# EAGLE design MYC_Klimasensor (EAGLE 7.3.0)
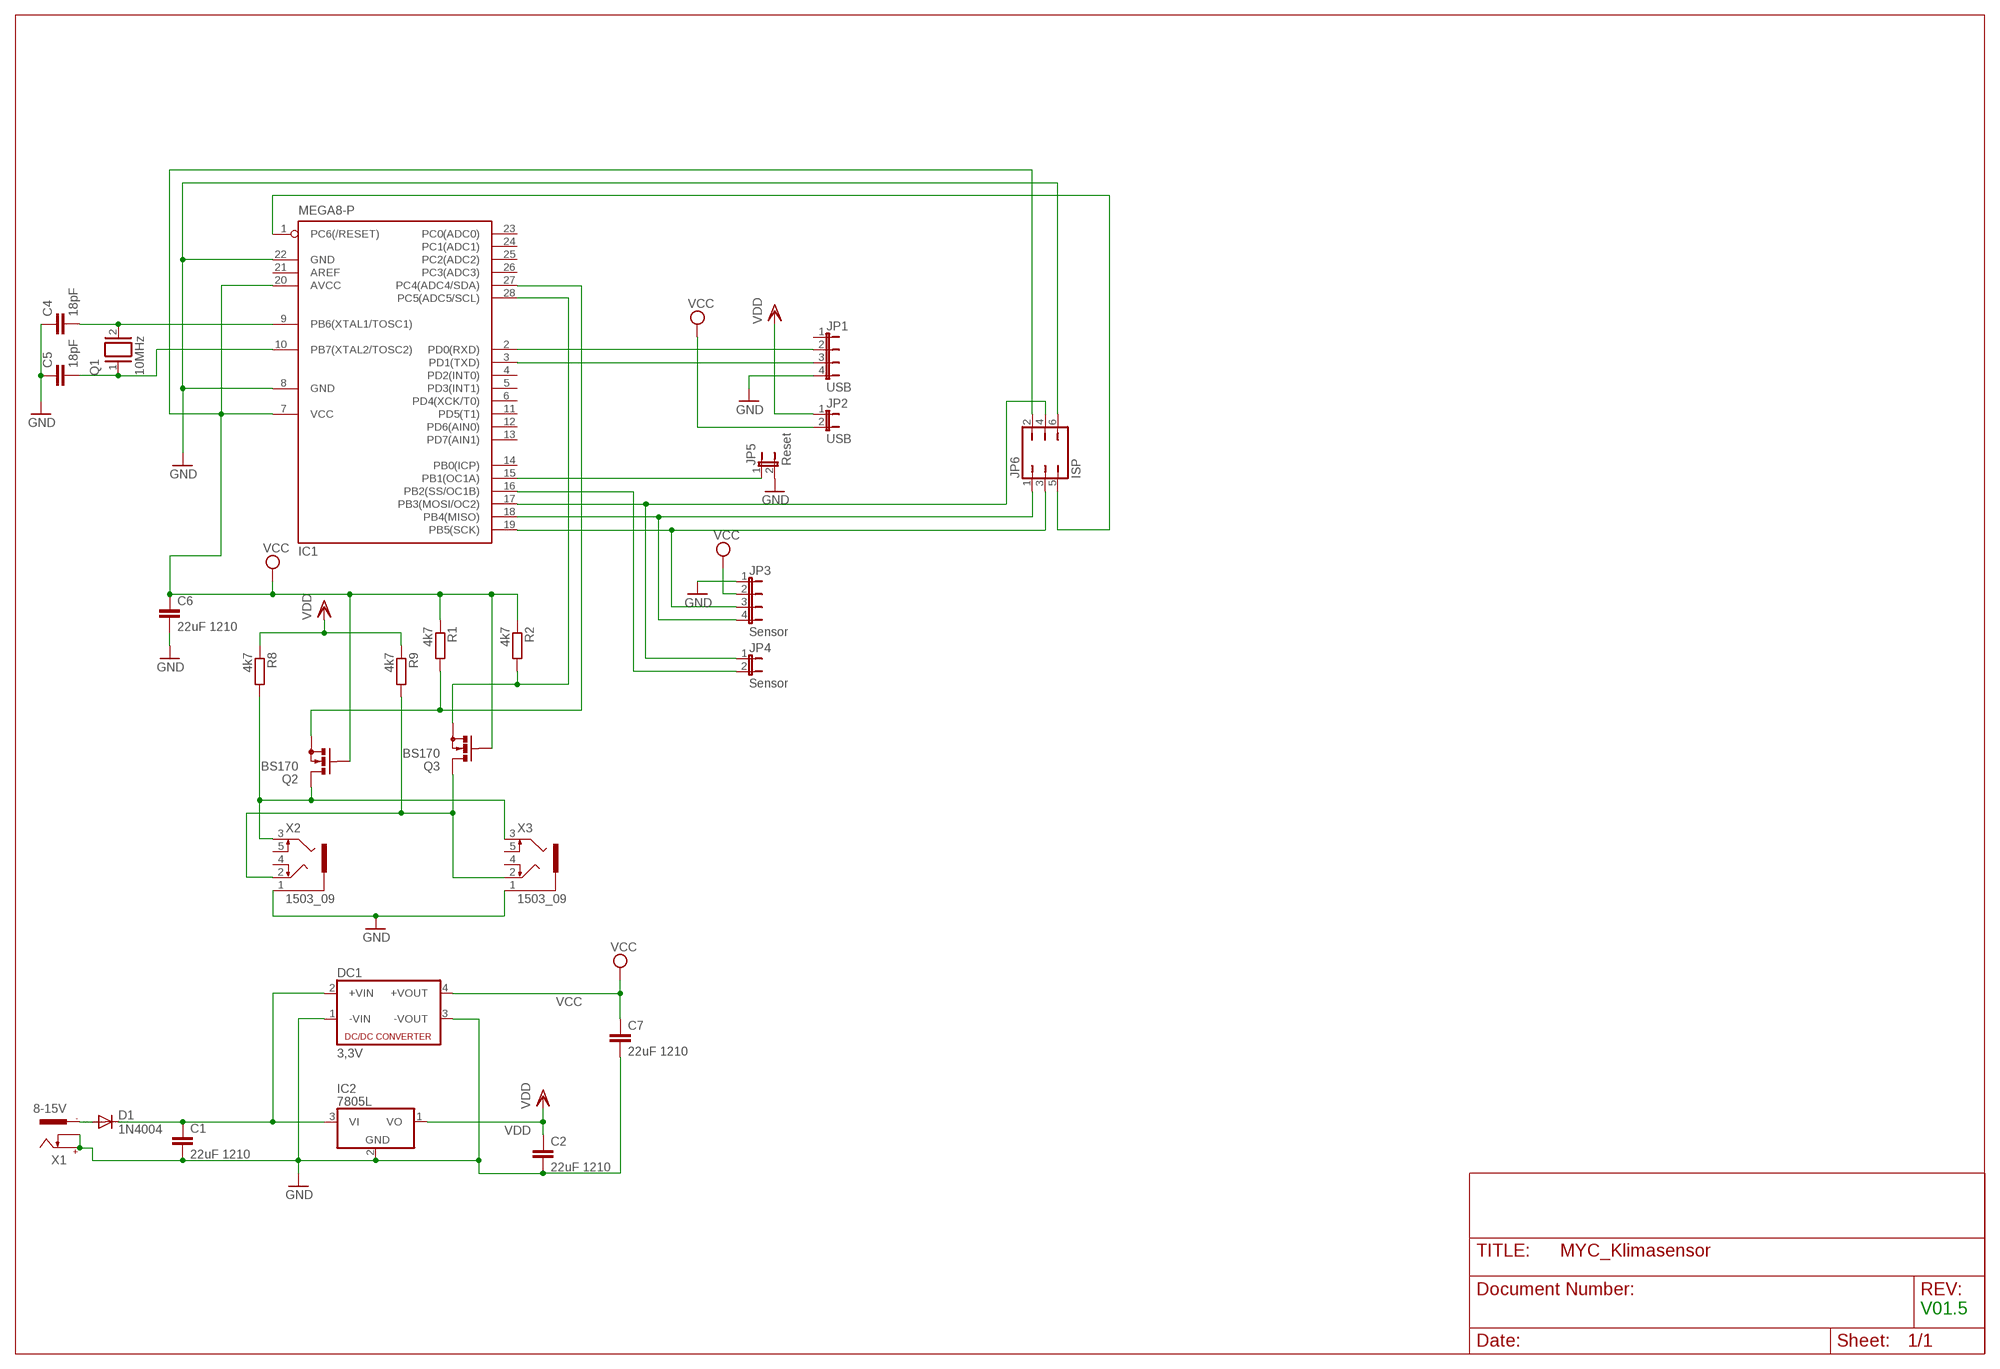
[diagram p0: schematic, sheet 1]

## Parts
C1  22uF 1210  C-EUC1206  [C1206]
C2  22uF 1210  C-EUC1206  [C1206]
C4  18pF  C-EU025-025X050  [C025-025X050]
C5  18pF  C-EU025-025X050  [C025-025X050]
C6  22uF 1210  C-EUC1206  [C1206]
C7  22uF 1210  C-EUC1206  [C1206]
D1  1N4004  [DO41-10]
DC1  3,3V  NME  [NME]
IC1  MEGA8-P  [DIL28-3]
IC2  7805L  [TO92]
JP1  USB  JP4E  [JP4]
JP2  USB  JP1E  [JP1]
JP3  Sensor  JP4E  [JP4]
JP4  Sensor  JP1E  [JP1]
JP5  Reset  JP1E  [JP1]
JP6  ISP  JP3Q  [JP3Q]
Q1  10MHz  XTAL/S  [QS]
Q2  BS170  [SOT54E]
Q3  BS170  [SOT54E]
R1  4k7  R-EU_R1206  [R1206]
R2  4k7  R-EU_R1206  [R1206]
R8  4k7  R-EU_R1206  [R1206]
R9  4k7  R-EU_R1206  [R1206]
X1  8-15V  737992-55  [737992-5]
X2  1503_09  [1503_09]
X3  1503_09  [1503_09]

## Nets
GND: C1.2 C2.2 C4.1 C5.1 C6.2 C7.2 DC1.1(-VIN) DC1.3(-VOUT) IC1.8(GND) IC1.22(GND) IC2.2(GND) JP1.4 JP3.1 JP5.2 JP6.6 X1.+ X1.K X2.1 X3.1
N$1: Q2.D R8.2 X2.3 X3.3
N$2: IC1.17(PB3(MOSI/OC2)) JP4.1 JP6.4
N$3: C1.1 D1.C DC1.2(+VIN) IC2.3(VI)
N$4: IC1.2(PD0(RXD)) JP1.2
N$5: IC1.27(PC4(ADC4/SDA)) Q2.S R1.2
N$7: IC1.28(PC5(ADC5/SCL)) Q3.S R2.2
N$8: IC1.19(PB5(SCK)) JP3.3 JP6.3
N$9: IC1.15(PB1(OC1A)) JP5.1
N$10: IC1.3(PD1(TXD)) JP1.3
N$11: IC1.16(PB2(SS/OC1B)) JP4.2
N$15: IC1.18(PB4(MISO)) JP3.4 JP6.1
N$18: IC1.1(PC6(/RESET)) JP6.5
N$19: C4.2 IC1.9(PB6(XTAL1/TOSC1)) Q1.2
N$22: Q3.D R9.2 X2.2 X3.2
N$27: D1.A X1.-1
N$37: C5.2 IC1.10(PB7(XTAL2/TOSC2)) Q1.1
VCC: C6.1 C7.1 DC1.4(+VOUT) IC1.7(VCC) IC1.20(AVCC) JP2.2 JP3.2 JP6.2 Q2.G Q3.G R1.1 R2.1
VDD: C2.1 IC2.1(VO) JP2.1 R8.1 R9.1
Unconnected: IC1.4(PD2(INT0)) IC1.5(PD3(INT1)) IC1.6(PD4(XCK/T0)) IC1.11(PD5(T1)) IC1.12(PD6(AIN0)) IC1.13(PD7(AIN1)) IC1.14(PB0(ICP)) IC1.21(AREF) IC1.23(PC0(ADC0)) IC1.24(PC1(ADC1)) IC1.25(PC2(ADC2)) IC1.26(PC3(ADC3)) JP1.1 X1.-2 X2.4 X2.5 X3.4 X3.5

## Notes on the sheet
- V01.5

## Library data of the parts
C1 C2 C6 C7 = rcl:C-EU: CAPACITOR, European symbol
C4 C5 = resistor:C-EU: CAPACITOR, European symbol
D1 = diode:1N4004: DIODE general purpose rectifier, 1 A
DC1 = dc-dc-converter:NME: DC-DC CONVERTER; MF: C & D TECHNOLOGIES, INC; MPN: NME1205D; OC_FARNELL: 1021466; OC_NEWARK: 98B8198
IC1 = atmel:MEGA8-P: MICROCONTROLLER 8 Kbytes FLASH, 1 kbytes SRAM, 512 bytes EEPROM, USART, 4-channel 10 bit ADC, 2-channel 8 bit ADC Pin compatible with Atmega48, ATMega88, ATMega168 Source: avr.lbr; OC_FARNELL: unknown; OC_NEWARK: unknown
IC2 = linear:78*: Positive VOLTAGE REGULATOR Source: http://cache.national.com/ds/LM/LM78L05.pdf http://www.fairchildsemi.com/ds/LM/LM7805.pdf
JP1 JP3 = jumper:JP4E: JUMPER
JP2 JP4 JP5 = jumper:JP1E: JUMPER
JP6 = jumper:JP3Q: JUMPER
Q1 = special:XTAL/S: CRYSTAL
Q2 Q3 = transistor-small-signal:BS170: N-CHANNEL MOS FET
R1 R2 R8 R9 = resistor:R-EU_: RESISTOR, European symbol
X1 = con-conrad:737992-55: FEMALE PRINT CONNECTOR DIN 45323 (34V/3A), ROKA, distributor Conrad
X2 X3 = con-lumberg:1503_09: Jack connectors according to JISC 6560, 3.5 mm Klinkeneinbaukupplung nach JISC 6560, 3,5 mm, 3-polig/ stereo, abgewinkelte Ausführung, mit 2 Öffnern und Lötaugen, für Leiterplatten Rückseitenmontage Source: http://www.lumberg.com/Produkte/PDFs/1503_09.pdf; OC_FARNELL: 1243244; OC_NEWARK: unknown

## Board
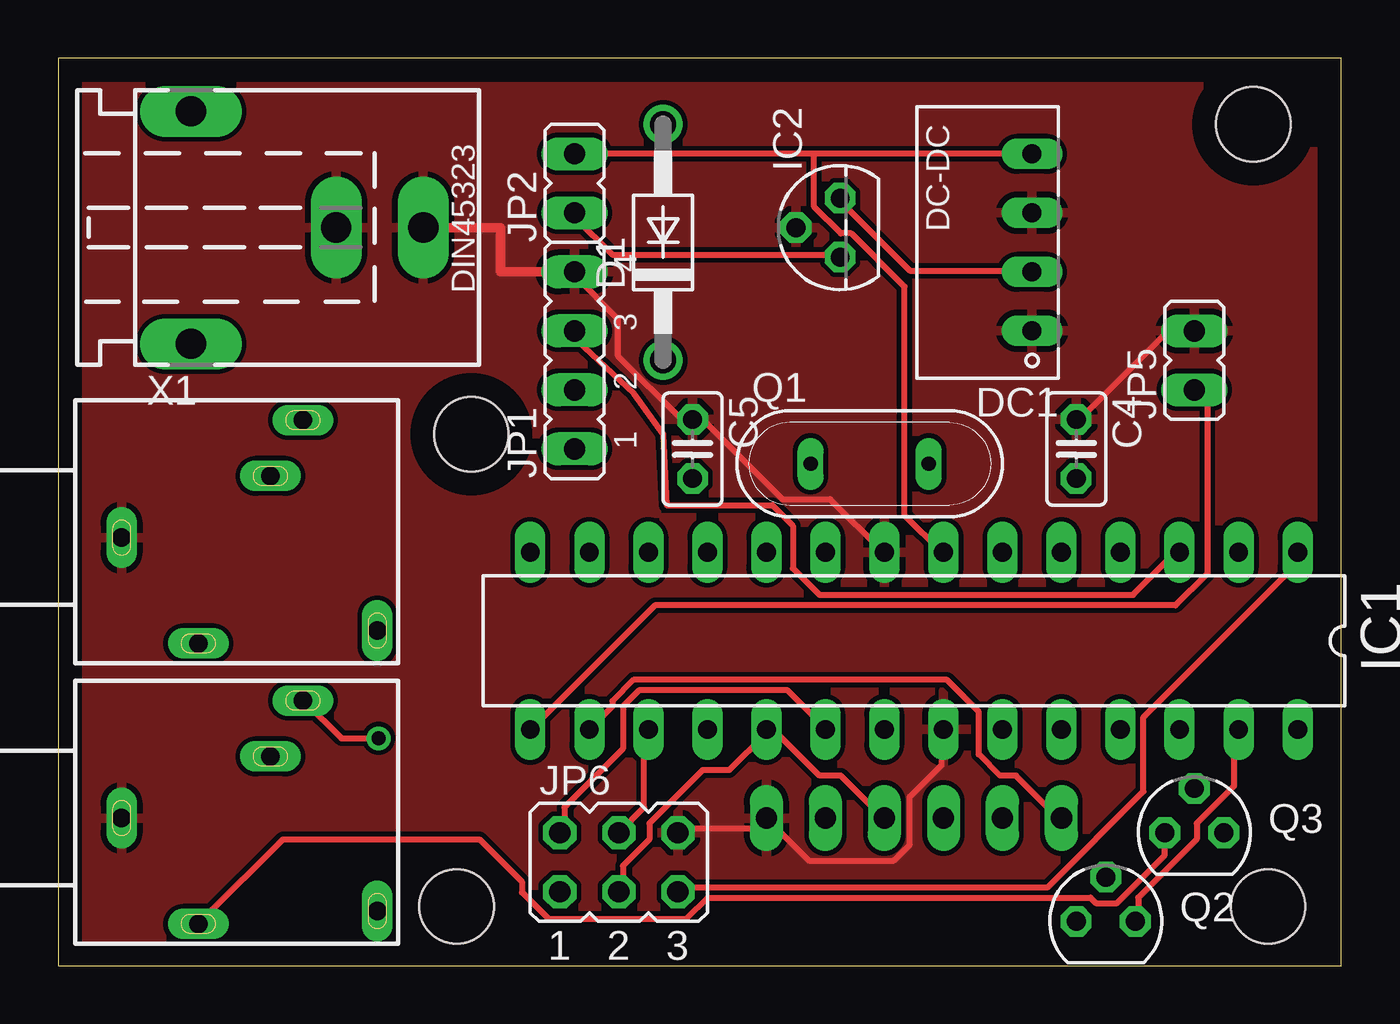
[diagram p1: board, top side]
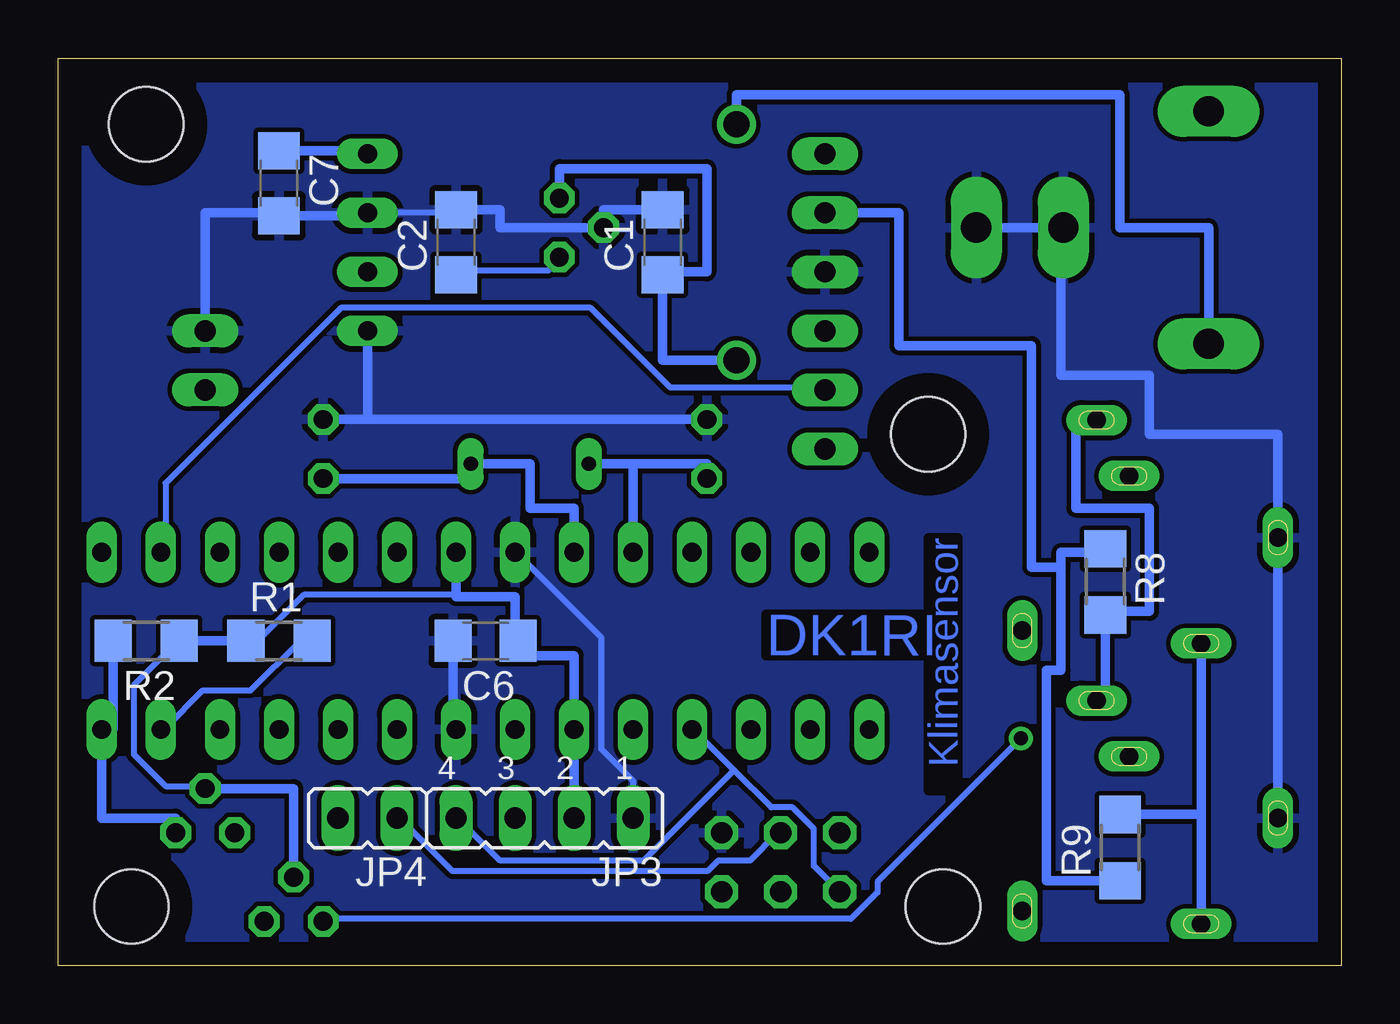
[diagram p2: board, bottom side, seen from below]

Size 55.23 x 39.04 mm. Coordinates in mm from the lower left corner, seen from the top.
Outline: 0,0 55.23,0 55.23,39.04 0,39.04 0,0
Copper layers (1*16): Top 0.035mm / dielectric 1.5mm / Bottom 0.035mm
Design rules "default": minimum track width 10mil, minimum drill 24mil, track to track 8mil, track to pad 8mil, pad to pad 8mil, via to via 8mil, smd to smd 8mil, copper to edge 40mil, drill to drill 8mil, minimum pad ring 10mil, minimum via ring 8mil, stop-mask expansion 4mil, vias tented up to drill 0mil, thermal gap 10mil
Holes 3.2 mm at 51.43,36.2 52.07,2.54 17.14,2.54 17.78,22.86

### Footprints (pad centres in the part's own frame; a part is rotated, then mirrored left to right if it is on the bottom)
C1206 = smd 1.6 x 1.8: 1 -1.4,0; 2 1.4,0
C025-025X050 = drill 0.813 octagon: 1 -1.27,0; 2 1.27,0
DO41-10 = drill 1.118: A 5.08,0; C -5.08,0
NME = drill 0.813 long: 1 0,3.81; 2 0,1.27; 3 0,-1.27; 4 0,-3.81
DIL28-3 = drill 0.813 long: 1 -16.51,-3.81; 2 -13.97,-3.81; 3 -11.43,-3.81; 4 -8.89,-3.81; 5 -6.35,-3.81; 6 -3.81,-3.81; 7 -1.27,-3.81; 8 1.27,-3.81; 9 3.81,-3.81; 10 6.35,-3.81; 11 8.89,-3.81; 12 11.43,-3.81; 13 13.97,-3.81; 14 16.51,-3.81; 15 16.51,3.81; 16 13.97,3.81; 17 11.43,3.81; 18 8.89,3.81; 19 6.35,3.81; 20 3.81,3.81; 21 1.27,3.81; 22 -1.27,3.81; 23 -3.81,3.81; 24 -6.35,3.81; 25 -8.89,3.81; 26 -11.43,3.81; 27 -13.97,3.81; 28 -16.51,3.81
TO92 = drill 0.813 octagon: 1 -1.27,0; 2 0,1.905; 3 1.27,0
JP4 = drill 0.914 long: 1 -3.81,0; 2 -1.27,0; 3 1.27,0; 4 3.81,0
JP1 = drill 0.914 long: 1 0,-1.27; 2 0,1.27
JP3Q = drill 0.914 octagon: 1 -2.54,-1.27; 2 -2.54,1.27; 3 0,-1.27; 4 0,1.27; 5 2.54,-1.27; 6 2.54,1.27
QS = drill 0.61 long: 1 -2.54,0; 2 2.54,0
SOT54E = drill 0.813 octagon: D -1.27,0; G 0,1.905; S 1.27,0
R1206 = smd 1.6 x 1.803: 1 -1.422,0; 2 1.422,0
737992-5 = drill 1.3 pad 2.184 long: + 0,10; -1 5,0; -2 -5,0; K 0,6.25
1503_09 = drill 0.8 pad 1.2 long: 1 0,-2.1; 2 -4.55,-5.4; 3 5.05,-9.9; 4 -4,-13.1; 5 2.65,-8.5

### Placement (x,y rotation side)
C1  29.21,31.11 90 bottom
C2  38.1,31.11 90 bottom
C4  43.81,22.23 270 top
C5  27.3,22.23 270 top
C6  36.83,13.97 180 bottom
C7  45.72,33.66 270 bottom
D1  26.03,31.11 90 top
DC1  41.91,31.11 180 top
IC1  36.83,13.97 180 top
IC2  33.66,31.75 90 top
JP1  22.23,26.03 90 top
JP2  22.23,33.66 0 top
JP3  34.29,6.35 180 bottom
JP4  41.91,6.35 90 bottom
JP5  48.9,26.03 0 top
JP6  24.13,4.45 0 top
Q1  34.92,21.59 0 top
Q2  45.09,1.9 0 top
Q3  48.9,5.72 0 top
R1  45.72,13.97 0 bottom
R2  51.43,13.97 180 bottom
R8  10.16,16.51 270 bottom
R9  9.53,5.08 90 bottom
X1  5.71,31.75 270 top
X2  0.63,6.35 90 top
X3  0.63,18.41 90 top

### Tracks (layer width: path | path; a pad name or v marks a point on that pad's centre or on a via)
GND
  Top 0.254: JP6.6 26.82,5.89 30.02,5.89 JP3.1 32.31,4.52 35.97,4.52 36.65,5.21 36.65,7.26 38.02,8.64 38.02,10.01 IC1.22 | IC1.8 35.51,17.78 33.22,20.07 31.17,20.07 27.74,23.49 C5.1 26.82,23.49 24.08,26.24 24.08,27.84 22.25,29.67 JP1.4 | JP5.2 48.77,27.15 47.62,27.15 43.97,23.49 C4.1
  Top 0.406: X1.+ 19.05,31.75 19.05,29.84 JP1.4
  Bottom 0.254: C2.2 38.25,32.41 41.91,32.41 DC1.3 | JP3.1 30.48,7.95 31.85,9.32 31.85,14.12 35.51,17.78 IC1.8
  Bottom 0.406: IC1.22 38.23,10.16 C6.2 | X2.1 X3.1 2.74,22.86 8.26,22.86 8.26,25.4 12.06,25.4 12.06,31.75 | 12.06,31.75 X1.+ | X1.K 12.06,31.75 | DC1.3 41.91,32.25 C7.2 45.72,32.38 48.9,32.38 JP5.2 | C4.1 41.91,23.49 | 41.91,23.49 DC1.1 | 41.91,23.49 C5.1 | C1.2 31.75,32.52 IC2.2 36.2,31.75 36.2,32.52 C2.2
  pour Bottom: 54.61,38.1 0.63,38.1 0.63,0.63 54.61,0.63
  pour Top: 54.61,38.1 0.63,38.1 0.63,0.63 54.61,0.63
N$1  (via drill 0.61)
  Top 0.254: v13.79,9.78 12.19,9.78 10.59,11.38 X2.3
  Bottom 0.254: v13.79,9.78 19.96,3.61 19.96,3.15 21.11,2.01 43.74,2.01 Q2.D
  Bottom 0.406: X2.3 10.16,11.4 R8.2 10.16,15.24 8.26,15.24 8.26,19.69 11.43,19.69 11.43,23.46 X3.3
N$2
  Top 0.254: JP6.4 25.22,6.81 25.22,10.01 IC1.17
  Bottom 0.254: JP4.1 40.54,6.35 38.25,4.06 27.28,4.06 26.82,4.52 25.45,4.52 24.31,5.66 JP6.4
N$3
  Top 0.254: DC1.2 41.91,29.9 36.65,29.9 33.68,32.87 IC2.3
  Bottom 0.406: D1.C 29.21,26.03 C1.1 29.21,29.84 27.3,29.84 27.3,34.29 33.66,34.29 IC2.3
N$4
  Bottom 0.254: IC1.2 50.6,17.78 50.6,20.75 43.05,28.3 32.31,28.3 28.88,24.87 22.25,24.87 JP1.2
N$5
  Top 0.254: Q2.S 46.48,2.01 46.48,2.92 49,5.44 49,6.12 50.6,7.72 50.6,10.01 IC1.27
  Bottom 0.254: R1.2 44.42,13.89 44.88,13.89 46.94,11.84 49,11.84 50.6,10.24 IC1.27
N$7
  Bottom 0.406: R2.2 52.86,10.16 IC1.28 53.34,6.35 50.16,6.35 Q3.S
N$8
  Top 0.254: 30.48,10.01 30.94,10.01 32.77,8.18 33.68,8.18 35.51,6.35 JP3.3 | 30.48,10.01 28.88,8.41 27.74,8.41 25.45,6.12 25.45,5.44 24.31,4.29 24.31,3.38 JP6.3 | 30.48,10.01 IC1.19
N$9
  Top 0.254: IC1.15 20.42,10.24 25.68,15.49 48.08,15.49 49.45,16.87 49.45,24.18 49,24.64 JP5.1
N$10
  Top 0.254: IC1.3 48.08,17.78 46.25,15.95 32.77,15.95 31.62,17.09 31.62,18.92 30.73,19.81 26.19,19.81 26.03,22.86 24.77,24.61 22.02,27.15 JP1.3
N$11
  Top 0.254: IC1.16 23.85,11.15 23.85,11.38 24.77,12.29 38.25,12.29 39.62,10.92 39.62,9.09 40.54,8.18 41.22,8.18 43.05,6.35 JP4.2
N$15
  Bottom 0.254: 26.14,8.41 24.54,6.81 23.62,6.81 22.71,5.89 22.71,4.29 JP6.1 | 26.14,8.41 27.74,10.01 IC1.18 | 26.14,8.41 30.02,4.52 36.2,4.52 38.02,6.35 JP3.4
N$18
  Top 0.254: IC1.1 53.34,17.32 46.71,10.69 46.71,7.49 42.6,3.38 26.82,3.38 JP6.5
N$19
  Bottom 0.406: C4.2 37.46,20.95 Q1.2 34.92,21.59 34.92,19.69 33.02,19.69 IC1.9
N$22
  Top 0.254: Q3.D 47.62,4.75 45.57,2.69 44.65,2.69 44.42,2.92 27.96,2.92 27.05,2.01 21.11,2.01 19.96,3.15 19.96,3.61 18.14,5.44 9.68,5.44 6.25,2.01 X2.2
  Bottom 0.406: X3.2 6.03,6.5 | 6.03,6.5 X2.2 | R9.2 6.03,6.5
N$27
  Bottom 0.406: D1.A 26.03,37.46 9.53,37.46 9.53,31.75 5.71,31.75 X1.-1
N$37
  Bottom 0.406: Q1.1 30.48,21.59 | 30.48,21.59 27.3,21.59 C5.2 | IC1.10 30.48,21.59
VCC
  Top 0.254: DC1.4 32.54,34.92 | 32.54,34.92 JP2.2 | JP6.2 21.79,5.89 21.79,6.81 24.31,9.32 24.31,11.15 24.99,11.84 31.39,11.84 32.99,10.24 IC1.20 | 32.54,34.92 32.54,32.64 33.68,31.5 34.14,31.5 36.42,29.21 36.42,19.38 38.02,17.78 IC1.7
  Bottom 0.254: R1.1 46.94,14.12 46.48,14.12 44.65,15.95 38.25,15.95 38.1,15.88 | Q3.G 49,7.72 50.6,7.72 51.97,9.09 51.97,12.06 50.14,13.89 R2.1
  Bottom 0.406: JP3.2 IC1.20 33.02,13.33 35.43,13.33 C6.1 35.56,13.97 35.56,15.88 38.1,15.88 IC1.7 | R1.1 R2.1 | Q3.G 45.09,7.62 Q2.G | C7.1 41.91,35.05 DC1.4
VDD
  Top 0.254: IC2.1 33.45,30.58 23.85,30.58 22.25,32.18 JP2.1
  Bottom 0.254: C2.1 38.02,29.9 34.14,29.9 33.68,30.35 IC2.1
  Bottom 0.406: R9.1 12.7,3.66 12.7,12.7 12.06,12.7 12.06,17.15 | R8.1 10.16,17.78 12.06,17.78 12.06,17.15 | JP2.1 19.05,32.38 19.05,26.67 13.33,26.67 13.33,17.15 12.06,17.15

### Text on the board
Bottom: Klimasensor | DK1RI